# Altium schematic sheet Digital.SchDoc
size A
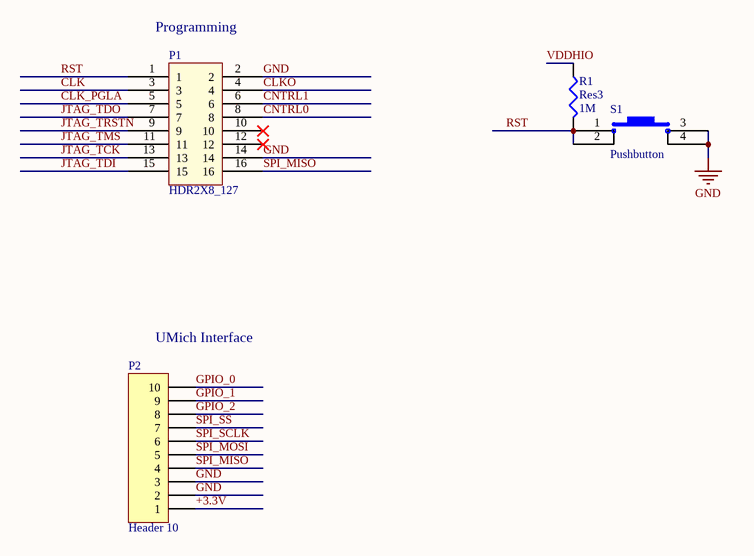
[diagram p0: Digital.SchDoc]

## Parts
P1  HDR2X8_127  [HDR2X8_127]
P2  Header 10  [505110-1092]
R1  Res3  value 1M  [0402]
S1  Pushbutton  [KMT031]

## Nets
GND: P1.2 P1.14 P2.2 P2.3 S1.3 S1.4
+3.3V: P2.1
CLK: P1.3
CLK_PGLA: P1.5
CLKO: P1.4
CNTRL0: P1.8
CNTRL1: P1.6
GPIO_0: P2.10
GPIO_1: P2.9
GPIO_2: P2.8
JTAG_TCK: P1.13
JTAG_TDI: P1.15
JTAG_TDO: P1.7
JTAG_TMS: P1.11
JTAG_TRSTN: P1.9
RST: P1.1 R1.2 S1.1 S1.2
SPI_MISO: P1.16 P2.4
SPI_MOSI: P2.5
SPI_SCLK: P2.6
SPI_SS: P2.7
VDDHIO: R1.1

Not connected (* = marked no-connect by the designer): P1 10* 12*

## Notes on the sheet
- (near P1) Programming
- (near P2) UMich Interface

## Library data of the parts
P1 = HDR2X8_127: Header 16 positions 1.27mm
P2 = Header 10: Header, 10-Pin; LatestRevisionDate: 17-Jul-2002; LatestRevisionNote: Re-released for DXP Platform.; Publisher: Altium Limited
R1 = Res3: Resistor; Published: 8-Jun-2000; LatestRevisionDate: 29-May-2009; LatestRevisionNote: IPC-7351 Footprint Added.; PackageReference: J1-0603; Publisher: Altium Limited; PackageDescription: Chip Resistor
S1 = PB_SW: Pushbutton, 4 leads